# Altium schematic sheet IMD.SchDoc
size A4; SheetNumber: 3; SheetTotal: 3; Schematic: Isolation Monitoring Device
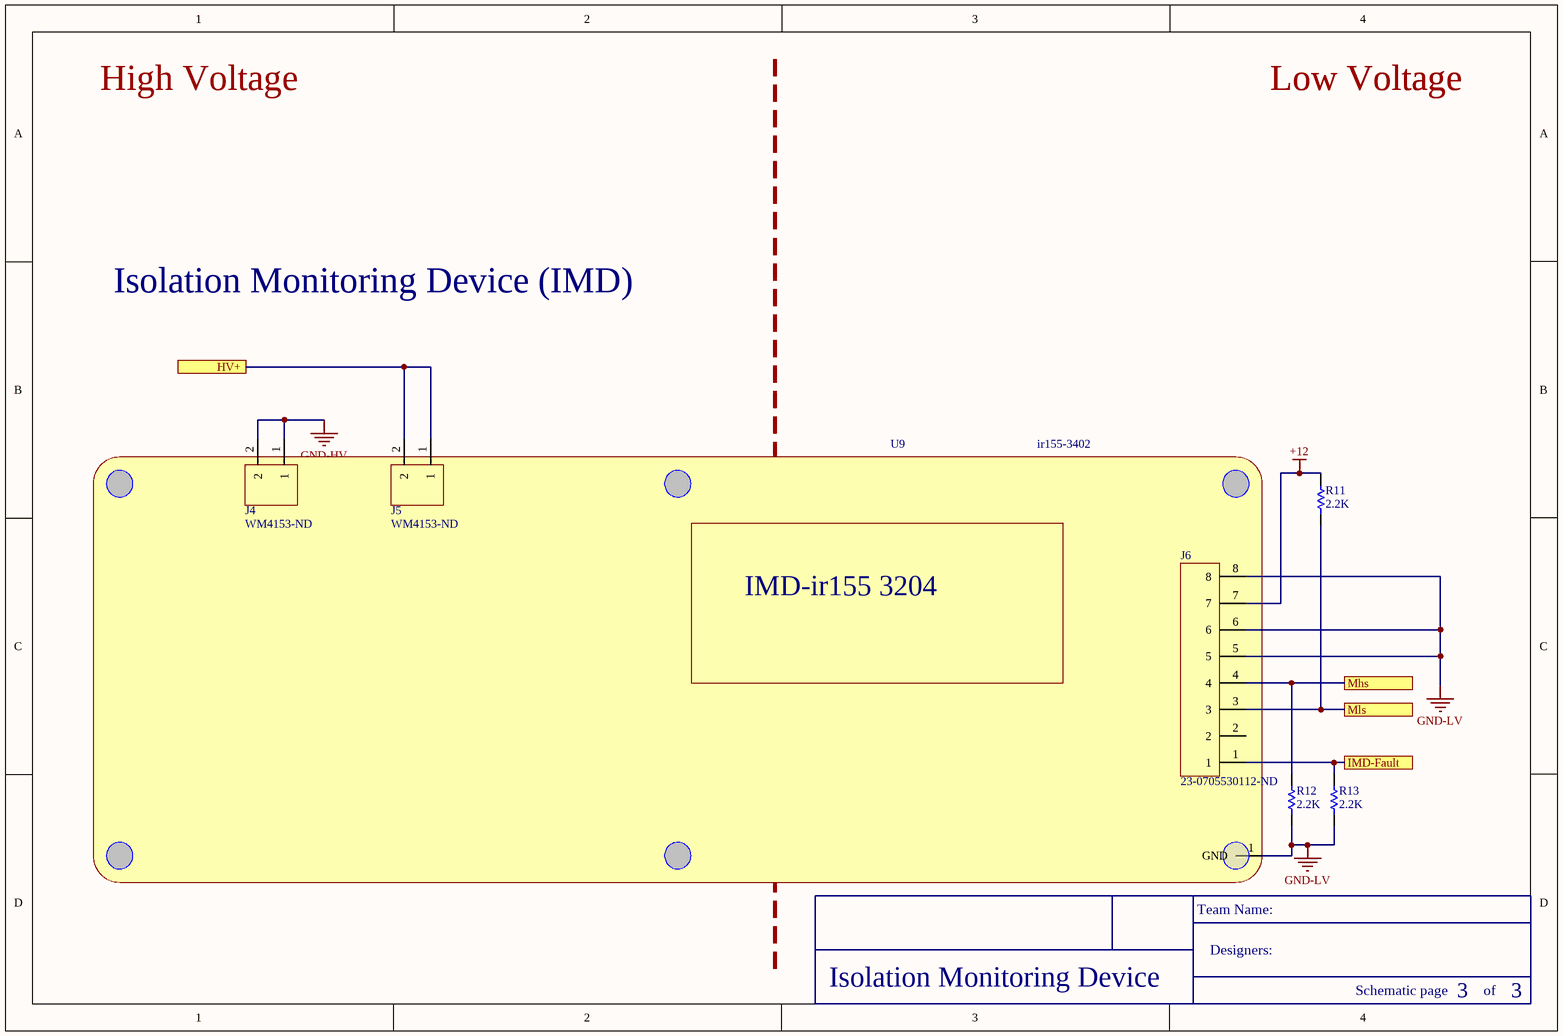
[diagram p0: IMD.SchDoc]

## Parts
J4  WM4153-ND  [2PIN]
J5  WM4153-ND  [2PIN]
J6  23-0705530112-ND  [8PIN]
R11  2.2K  [RES-0805]
R12  2.2K  [RES-0805]
R13  2.2K  [RES-0805]
U9  ir155-3402  [IMD-Bender ir155 3204]

## Ports
HV+, IMD-Fault, Mhs, Mls

## Nets
+12: J6.7 R11.2
GND-HV: J4.1 J4.2
GND-LV: J6.5 J6.6 J6.8 R12.1 R13.1 U9.1(GND)
HV+: J5.1 J5.2 ; port HV+
IMD-Fault: J6.1 R13.2 ; port IMD-Fault
Mhs: J6.4 R12.2 ; port Mhs
Mls: J6.3 R11.1 ; port Mls

Not connected (* = marked no-connect by the designer): J6 2

## Notes on the sheet
- Low Voltage
- Isolation Monitoring Device (IMD)
- High Voltage
- Team Name:
- Designers:
- Schematic page
- of
- (in symbol IMD-ir155-3402) IMD-ir155 3204

## Library data of the parts
J4 J5 = 2PIN: CONN HEADER R/A 2POS 2.54MM; Manufacturer: Molex; Manufacturer Part Number: 0705530106; Number of Positions: 2; Contact Resistance: 30mR; Connector Type: Male Pin; Supplier 1: Digi-Key; Stock 1: 2224; Pricing 1: 1=1.38, 10=1.25, 100=1.071, 500=0.8925, 1000=0.765, 5000=0.6783, 10000=0.663 (USD); Mount: Through Hole; Housing Material: Polyester; Contact Plating: Gold; Contact Material: Bronze; Color: Black; Housing Color: Black; Min Operating Temperature: -40°C; Max Operating Temperature: 105°C; Number of Rows: 1; Packaging: Rail/Tube; Termination: Solder; Number of Contacts: 2; Orientation: Right Angle; Length: 7.37mm; Pitch: 2.54mm; Depth: 13.59mm; Contact Mating Length: 0.24inch; ComponentLink1URL: http://www.molex.com/webdocs/datasheets/pdf/en-us/0705530106_PCB_HEADERS.pdf?src-supplier=Avnet+Asia; ComponentLink1Description: http://www.molex.com/webdocs/datasheets/pdf/en-us/0705530106_PCB_HEADERS.pdf?src-supplier=Avnet+Asia; ComponentLink2URL: https://www.molex.com/pdm_docs/ps/PS-70400.pdf?src-supplier=Digi-Key; ComponentLink2Description: https://www.molex.com/pdm_docs/ps/PS-70400.pdf?src-supplier=Digi-Key; Supplier Part Number 1: WM4153-ND
J6 = 8PIN: CONN HEADER R/A 8POS 2.54MM; Manufacturer: Molex; Manufacturer Part Number: 70553-0112; Contact Resistance: 30mR; Current Rating: 3A; Voltage Rating: 250V; Number of Positions: 8; Insulation Resistance: 1GR; Connector Type: Male Pin; Glow Wire Compliant: Non-compliant; Supplier 1: Digi-Key; Stock 1: 1363; Pricing 1: 1=2.43, 10=2.205, 100=1.89, 500=1.575, 1000=1.35, 5000=1.197, 10000=1.17 (USD); Mount: Through Hole; Color: Black; Contact Material: Bronze; Contact Plating: Gold; Material: Brass; Housing Material: Thermoplastic; Min Operating Temperature: -40°C; Max Operating Temperature: 105°C; Package Quantity: 1; Number of Rows: 1; Packaging: Rail/Tube; Termination: Solder; Number of Contacts: 8; Orientation: Right Angle; Voltage Rating (DC): 250V; Number of Circuits: 8; Pitch: 2.54mm; Contact Mating Length: 0.24inch; ELV: Compliant; Flammability Rating: UL94 V-0; ComponentLink1URL: https://www.molex.com/pdm_docs/ps/PS-70400.pdf?src-supplier=Digi-Key; ComponentLink1Description: https://www.molex.com/pdm_docs/ps/PS-70400.pdf?src-supplier=Digi-Key; ComponentLink2URL: http://www.mouser.com/ds/2/276/0705530112_PCB_HEADERS-172840.pdf?src-supplier=Mouser; ComponentLink2Description: http://www.mouser.com/ds/2/276/0705530112_PCB_HEADERS-172840.pdf?src-supplier=Mouser; Supplier Part Number 1: 23-0705530112-ND
R11-R13 = 0805-2.2KR: RES SMD 2.2K OHM 1% 1/8W 0805; Manufacturer: Yageo; Manufacturer Part Number: RC0805FR-072K2L; Power Rating: 125mW; Resistance: 2.2kR; Temperature Coefficient: 100ppm/°C; Voltage Rating: 150V; Supplier 1: Digi-Key; Stock 1: 4156138; Pricing 1: 1=0.1, 10=0.04, 100=0.0163, 1000=0.00731, 2500=0.00635 (USD); Case/Package: 0805; Number of Pins: 2; Case Code (Imperial): 0805; Case Code (Metric): 2012; Min Operating Temperature: -55°C; Max Operating Temperature: 155°C; Tolerance: 1%; Packaging: Tape and Reel; Voltage Rating (DC): 150V; Package Quantity: 1; Termination: SMD/SMT; Composition: Thick Film; Number of Terminations: 2; Max Power Dissipation: 125mW; Features: Moisture Resistant; Military Standard: Not; Length: 2mm; Height: 0.5mm; Width: 1.25mm; Depth: 1.25mm; Lead Pitch: 0.4mm; REACH SVHC: Unknown; Lead Free: Lead Free; ComponentLink1URL: http://www.farnell.com/datasheets/38627.pdf?src-supplier=Element14; ComponentLink1Description: http://www.farnell.com/datasheets/38627.pdf?src-supplier=Element14; ComponentLink2URL: http://www.farnell.com/datasheets/444164.pdf?src-supplier=Element14; ComponentLink2Description: http://www.farnell.com/datasheets/444164.pdf?src-supplier=Element14; ComponentLink3URL: http://www.yageo.com/documents/recent/PYu-RC_Group_51_RoHS_L_9.pdf?src-supplier=Digi-Key; ComponentLink3Description: http://www.yageo.com/documents/recent/PYu-RC_Group_51_RoHS_L_9.pdf?src-supplier=Digi-Key; ComponentLink4URL: http://www.yageo.com/documents/recent/PYu-RC_Group_51_RoHS_L_10.pdf?src-supplier=Digi-Key; ComponentLink4Description: http://www.yageo.com/documents/recent/PYu-RC_Group_51_RoHS_L_10.pdf?src-supplier=Digi-Key; Supplier Part Number 1: 311-2.20KCRDKR-ND
U9 = IMD-ir155-3402: ISOMETER iso-F1 IR155-3204